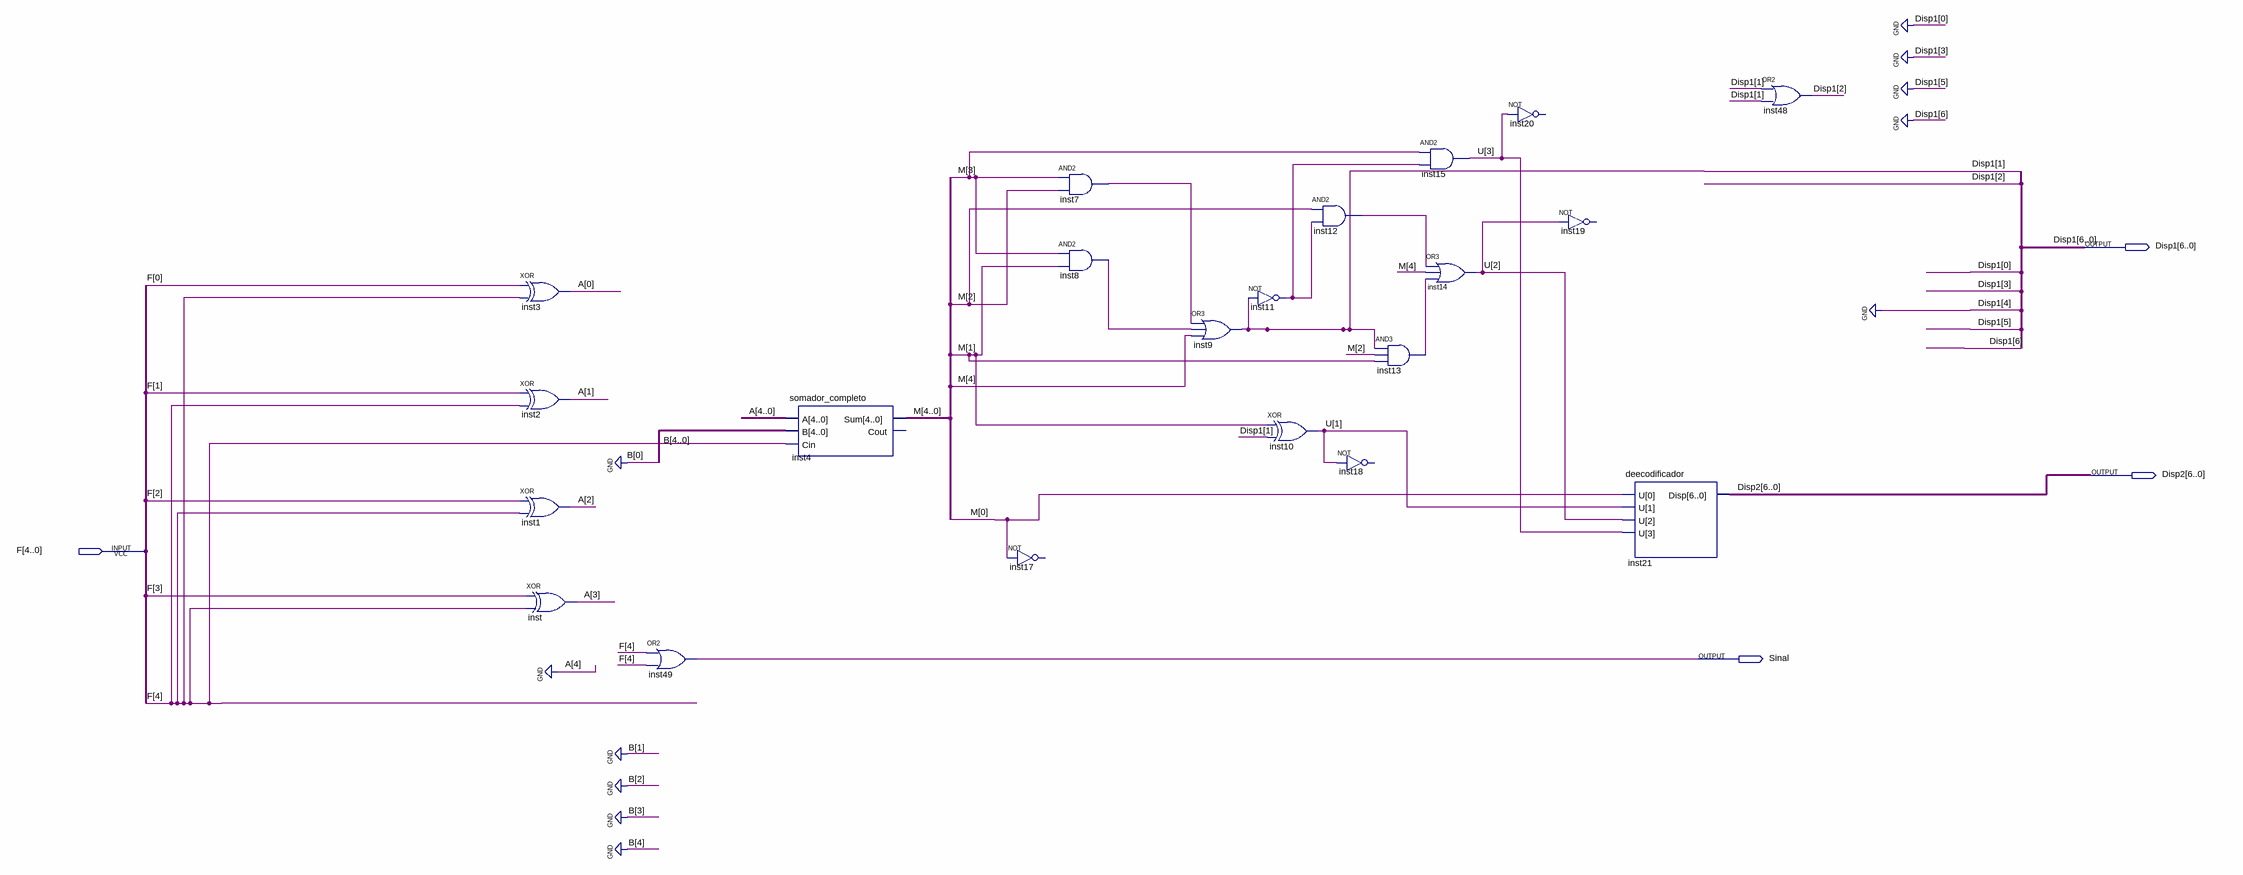
[diagram p0: schematic sheet]
// Quartus schematic display.bdf as structural Verilog: 21 symbols, 4 pins
module display (
  input  [4:0] F,
  output [6:0] Disp1,
  output [6:0] Disp2,
  output Sinal
);

  wire inst7_out, inst8_out, inst11_out, inst12_out, inst13_out;
  wire [3:0] A;
  wire [3:1] U;
  wire [4:0] M;

  xor inst3 (A[0], F[0], F[4]);
  xor inst2 (A[1], F[1], F[4]);
  xor inst1 (A[2], F[2], F[4]);
  xor inst (A[3], F[3], F[4]);
  or inst49 (Sinal, F[4], F[4]);
  somador_completo inst4 (.A({1'b0, A}), .B({5{1'b0}}), .Cin(F[4]), .Sum(M));  // open: Cout
  // NOT inst17 has open pins: IN=M[0], OUT=open
  and inst7 (inst7_out, M[3], M[2]);
  and inst8 (inst8_out, M[3], M[1]);
  or inst9 (Disp1[1], inst7_out, inst8_out, M[4]);
  not inst11 (inst11_out, Disp1[1]);
  xor inst10 (U[1], M[1], Disp1[1]);
  and inst12 (inst12_out, M[2], inst11_out);
  // NOT inst18 has open pins: IN=U[1], OUT=open
  and inst13 (inst13_out, Disp1[1], M[2], M[1]);
  and inst15 (U[3], M[3], inst11_out);
  or inst14 (U[2], inst12_out, M[4], inst13_out);
  // NOT inst20 has open pins: IN=U[3], OUT=open
  // NOT inst19 has open pins: IN=U[2], OUT=open
  deecodificador inst21 (.U({U, M[0]}), .Disp(Disp2));
  or inst48 (Disp1[2], Disp1[1], Disp1[1]);

  assign {Disp1[6:3], Disp1[0]} = {5{1'b0}};
endmodule
